# Altium schematic sheet BreakOut_20172.SchDoc
size A2; Author: Audran; CompanyName: Goldorak; Address1: Electrolab; Address2: 52 rue Paul Lescop; Address3: 92000 Nanterre; ProjectName: Cartes_2017
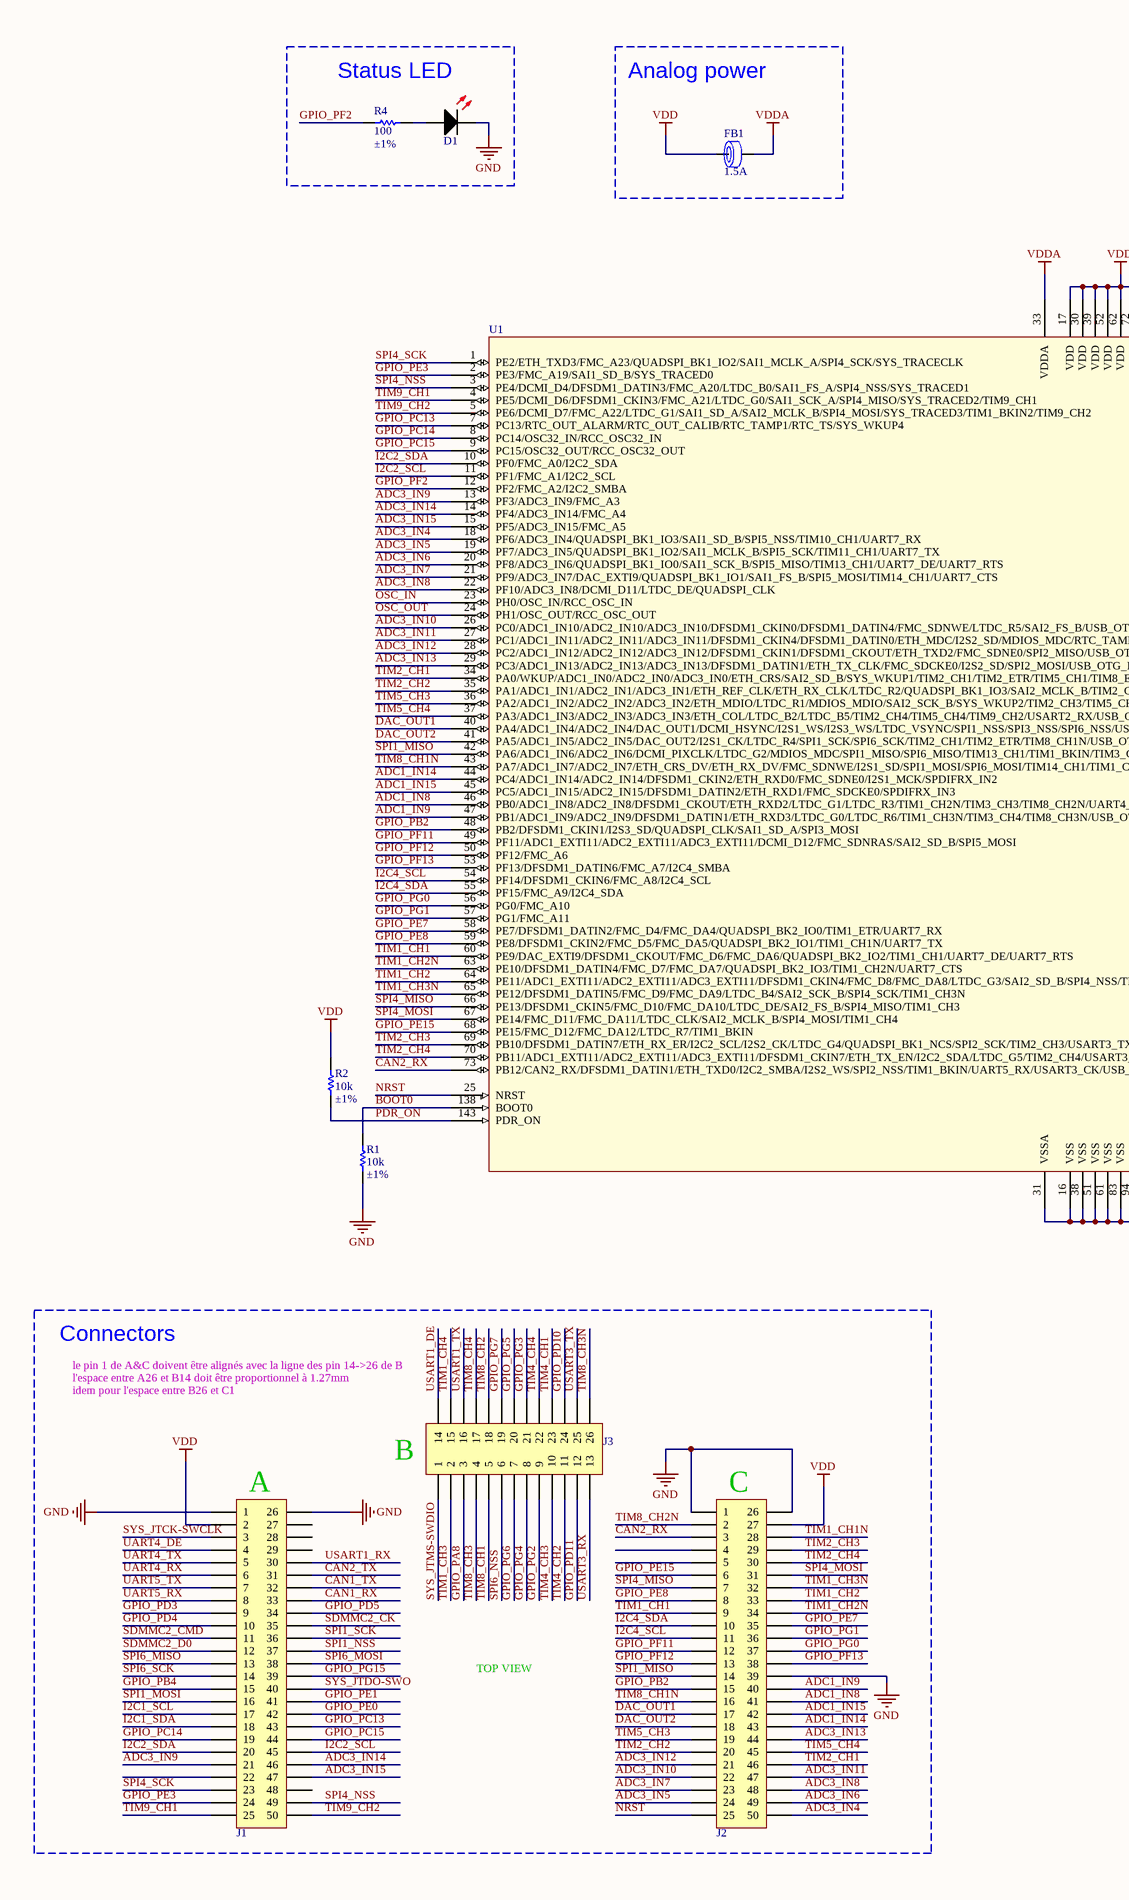
[diagram p0: BreakOut_20172.SchDoc, left]
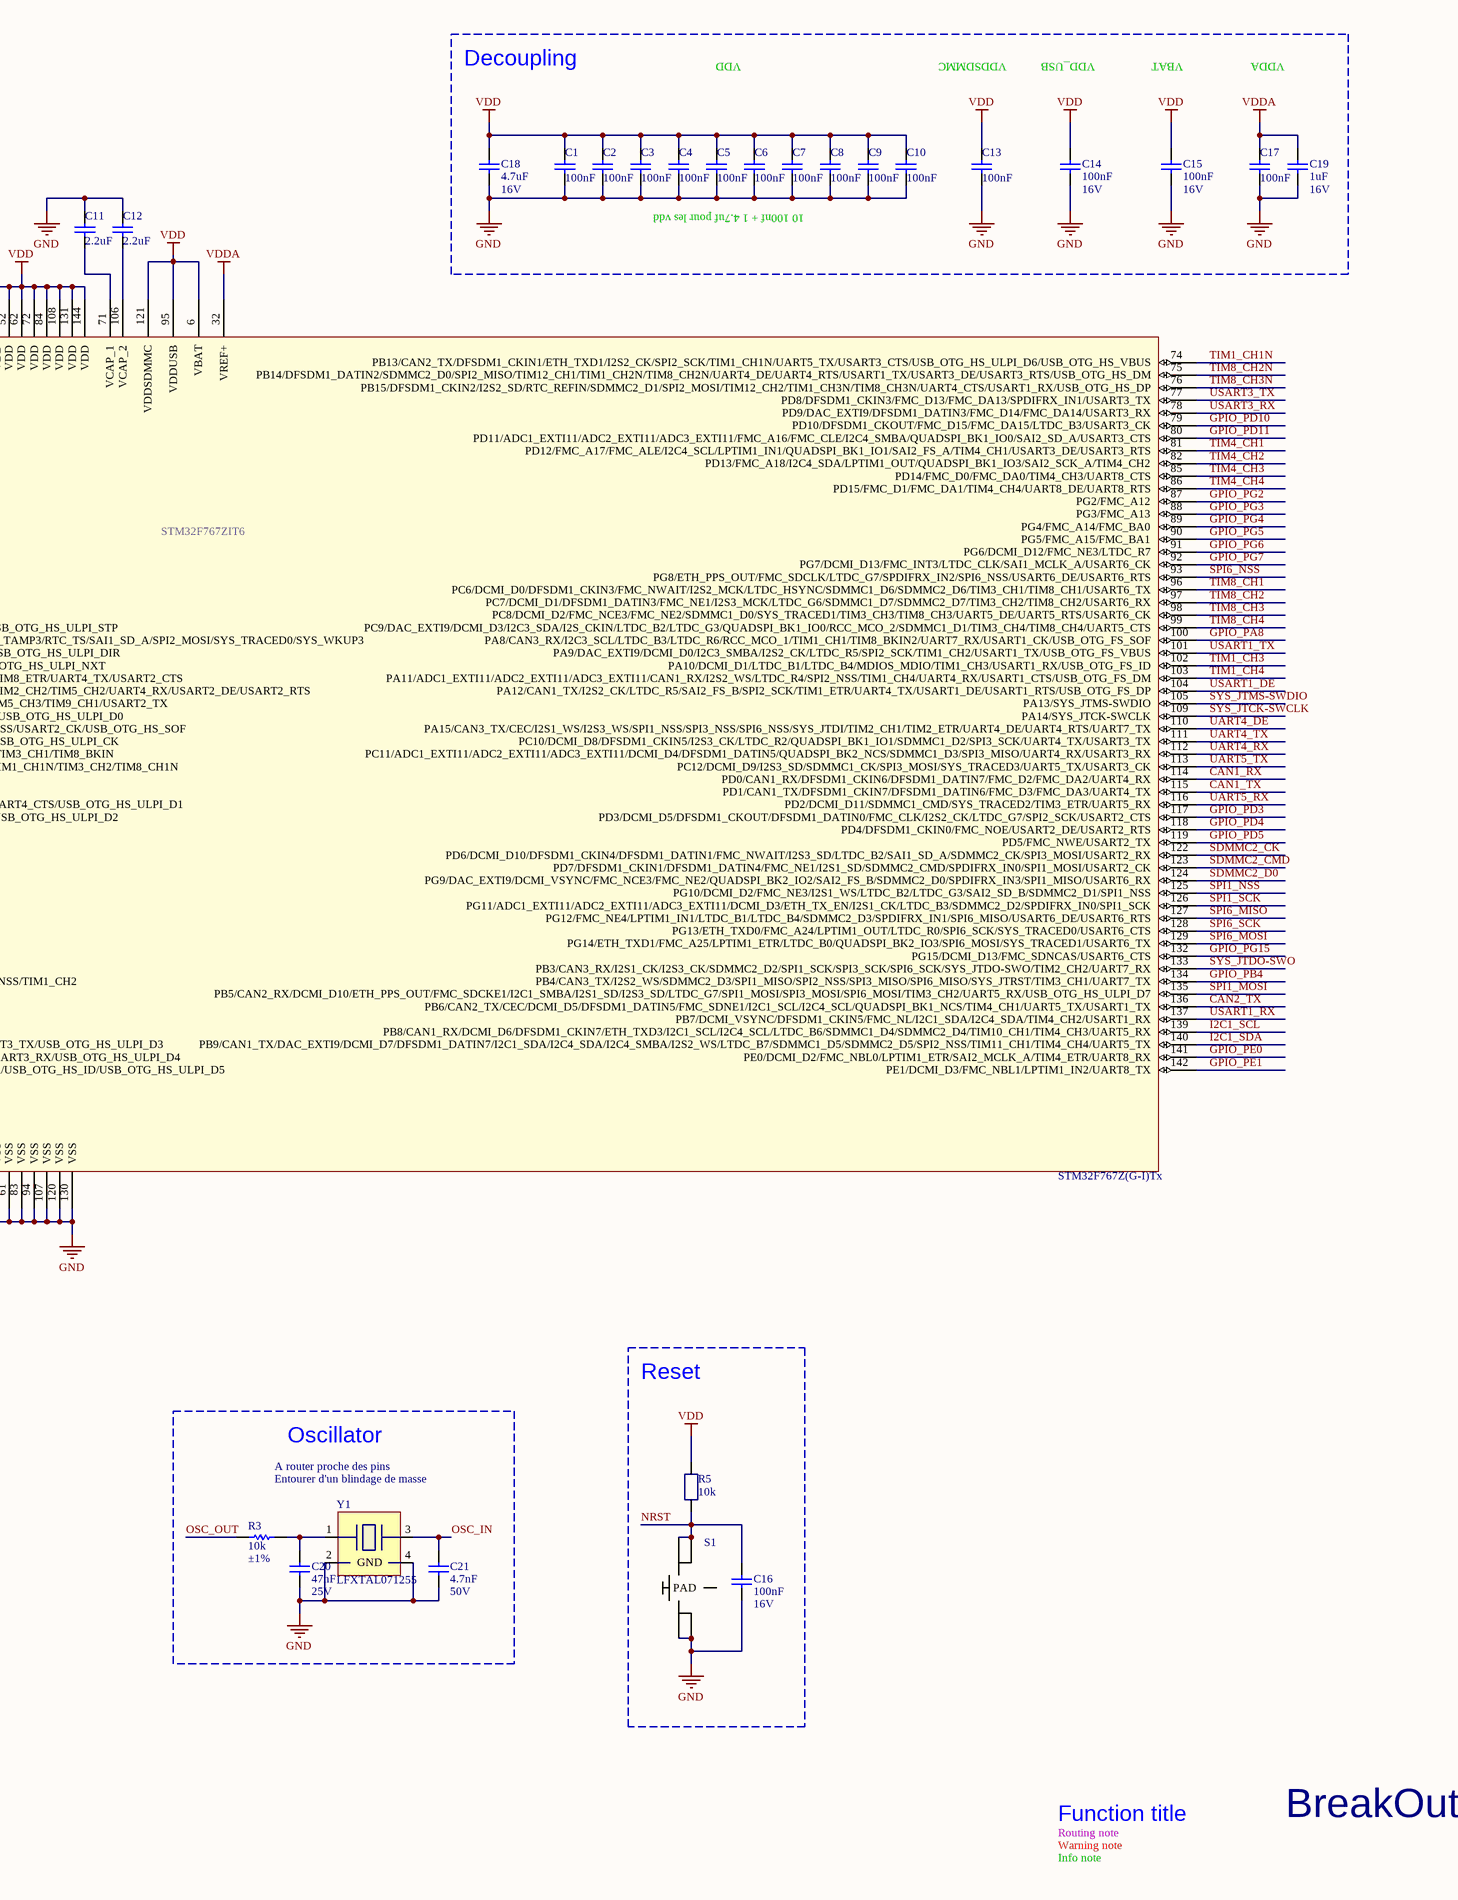
[diagram p1: BreakOut_20172.SchDoc, right]

## Parts
C1  100nF  [WCAP-CSGP_0402, 1x0.5x0.5]
C2  100nF  [WCAP-CSGP_0402, 1x0.5x0.5]
C3  100nF  [WCAP-CSGP_0402, 1x0.5x0.5]
C4  100nF  [WCAP-CSGP_0402, 1x0.5x0.5]
C5  100nF  [WCAP-CSGP_0402, 1x0.5x0.5]
C6  100nF  [WCAP-CSGP_0402, 1x0.5x0.5]
C7  100nF  [WCAP-CSGP_0402, 1x0.5x0.5]
C8  100nF  [WCAP-CSGP_0402, 1x0.5x0.5]
C9  100nF  [WCAP-CSGP_0402, 1x0.5x0.5]
C10  100nF  [WCAP-CSGP_0402, 1x0.5x0.5]
C11  2.2uF  [WCAP-CSGP_0603, 1.6x0.8x0.8]
C12  2.2uF  [WCAP-CSGP_0603, 1.6x0.8x0.8]
C13  100nF  [WCAP-CSGP_0402, 1x0.5x0.5]
C14  100nF  RatedVoltage: 16V  [WCAP-CSGP_0402, 1x0.5x0.5]
C15  100nF  RatedVoltage: 16V  [WCAP-CSGP_0402, 1x0.5x0.5]
C16  100nF  RatedVoltage: 16V  [WCAP-CSGP_0402, 1x0.5x0.5]
C17  100nF  [WCAP-CSGP_0402, 1x0.5x0.5]
C18  4.7uF  RatedVoltage: 16V  [WCAP-CSGP_0805, 2x1.25x1.25]
C19  1uF  RatedVoltage: 16V  [WCAP-CSGP_0603, 1.6x0.8x0.8]
C20  47nF  RatedVoltage: 25V  [WCAP-CSGP_0402, 1x0.5x0.5]
C21  4.7nF  RatedVoltage: 50V  [WCAP-CSGP_0402, 1x0.5x0.5]
D1  Rouge  [SMCW_0603]  (value not drawn)
FB1  RatedCurrent: 1.5A  [WE-CBF_0603_High Current]  (hidden comment: 742792624)
J1  WE-1.27 mm Socket Header 623350235321  [623350235321]  (value not drawn)
J2  WE-1.27 mm Socket Header 623350235321  [623350235321]  (value not drawn)
J3  WE-1.27 mm Socket Header 6623326235321  [623326235321]  (value not drawn)
R1  value 10k  Precision: ±1%  [RESC1005X04N]  (hidden comment: RC0402FR-0710KL)
R2  value 10k  Precision: ±1%  [RESC1005X04N]  (hidden comment: RC0402FR-0710KL)
R3  value 10k  Precision: ±1%  [RESC1005X04N]  (hidden comment: RC0402FR-0710KL)
R4  value 100  Precision: ±1%  [RESC1005X04N]  (hidden comment: RC0402FR-07100RL)
R5  10k  [R_0603_std]
S1  MCITPG  [MCIPTG23K-V]  (value not drawn)
U1  STM32F767Z(G-I)Tx  [TSQFP50P2200X2200X160-144N]
Y1  LFXTAL071255  [LFXTAL071255]

## Blocks framed on the sheet
Decoupling: C1-C10 C13-C15 C17-C19
Status LED: D1 R4
Analog power: FB1
Reset: C16 R5 S1
Oscillator: C20 C21 R3 Y1

## Nets
GND: C1.2 C2.1 C3.1 C4.1 C5.1 C6.1 C7.1 C8.1 C9.1 C10.1 C11.2 C12.2 C13.1 C14.1 C15.1 C16.1 C17.1 C18.1 C19.1 C20.1 C21.1 D1.1(C) J1.1 J1.26 J2.1 J2.26 J2.39 R1.1 S1.1 S1.3 U1.16(VSS) U1.31(VSSA) U1.38(VSS) U1.51(VSS) U1.61(VSS) U1.83(VSS) U1.94(VSS) U1.107(VSS) U1.120(VSS) U1.130(VSS) Y1.2(GND) Y1.4(GND)
VDD: C1.1 C2.2 C3.2 C4.2 C5.2 C6.2 C7.2 C8.2 C9.2 C10.2 C13.2 C14.2 C15.2 C18.2 FB1.1 J1.2 J2.27 R2.2 R5.1 U1.6(VBAT) U1.17(VDD) U1.30(VDD) U1.39(VDD) U1.52(VDD) U1.62(VDD) U1.72(VDD) U1.84(VDD) U1.95(VDDUSB) U1.108(VDD) U1.121(VDDSDMMC) U1.131(VDD) U1.144(VDD)
VDDA: C17.2 C19.2 FB1.2 U1.32(VREF+) U1.33(VDDA)
ADC1_IN8: J2.41 U1.46(PB0/ADC1_IN8/ADC2_IN8/DFSDM1_CKOUT/ETH_RXD2/LTDC_G1/LTDC_R3/TIM1_CH2N/TIM3_CH3/TIM8_CH2N/UART4_CTS/USB_OTG_HS_ULPI_D1)
ADC1_IN9: J2.40 U1.47(PB1/ADC1_IN9/ADC2_IN9/DFSDM1_DATIN1/ETH_RXD3/LTDC_G0/LTDC_R6/TIM1_CH3N/TIM3_CH4/TIM8_CH3N/USB_OTG_HS_ULPI_D2)
ADC1_IN14: J2.43 U1.44(PC4/ADC1_IN14/ADC2_IN14/DFSDM1_CKIN2/ETH_RXD0/FMC_SDNE0/I2S1_MCK/SPDIFRX_IN2)
ADC1_IN15: J2.42 U1.45(PC5/ADC1_IN15/ADC2_IN15/DFSDM1_DATIN2/ETH_RXD1/FMC_SDCKE0/SPDIFRX_IN3)
ADC3_IN4: J2.50 U1.18(PF6/ADC3_IN4/QUADSPI_BK1_IO3/SAI1_SD_B/SPI5_NSS/TIM10_CH1/UART7_RX)
ADC3_IN5: J2.24 U1.19(PF7/ADC3_IN5/QUADSPI_BK1_IO2/SAI1_MCLK_B/SPI5_SCK/TIM11_CH1/UART7_TX)
ADC3_IN6: J2.49 U1.20(PF8/ADC3_IN6/QUADSPI_BK1_IO0/SAI1_SCK_B/SPI5_MISO/TIM13_CH1/UART7_DE/UART7_RTS)
ADC3_IN7: J2.23 U1.21(PF9/ADC3_IN7/DAC_EXTI9/QUADSPI_BK1_IO1/SAI1_FS_B/SPI5_MOSI/TIM14_CH1/UART7_CTS)
ADC3_IN8: J2.48 U1.22(PF10/ADC3_IN8/DCMI_D11/LTDC_DE/QUADSPI_CLK)
ADC3_IN9: J1.21 U1.13(PF3/ADC3_IN9/FMC_A3)
ADC3_IN10: J2.22 U1.26(PC0/ADC1_IN10/ADC2_IN10/ADC3_IN10/DFSDM1_CKIN0/DFSDM1_DATIN4/FMC_SDNWE/LTDC_R5/SAI2_FS_B/USB_OTG_HS_ULPI_STP)
ADC3_IN11: J2.47 U1.27(PC1/ADC1_IN11/ADC2_IN11/ADC3_IN11/DFSDM1_CKIN4/DFSDM1_DATIN0/ETH_MDC/I2S2_SD/MDIOS_MDC/RTC_TAMP3/RTC_TS/SAI1_SD_A/SPI2_MOSI/SYS_TRACED0/SYS_WKUP3)
ADC3_IN12: J2.21 U1.28(PC2/ADC1_IN12/ADC2_IN12/ADC3_IN12/DFSDM1_CKIN1/DFSDM1_CKOUT/ETH_TXD2/FMC_SDNE0/SPI2_MISO/USB_OTG_HS_ULPI_DIR)
ADC3_IN13: J2.44 U1.29(PC3/ADC1_IN13/ADC2_IN13/ADC3_IN13/DFSDM1_DATIN1/ETH_TX_CLK/FMC_SDCKE0/I2S2_SD/SPI2_MOSI/USB_OTG_HS_ULPI_NXT)
ADC3_IN14: J1.46 U1.14(PF4/ADC3_IN14/FMC_A4)
ADC3_IN15: J1.47 U1.15(PF5/ADC3_IN15/FMC_A5)
BOOT0: R1.2 U1.138(BOOT0)
CAN1_RX: J1.33 U1.114(PD0/CAN1_RX/DFSDM1_CKIN6/DFSDM1_DATIN7/FMC_D2/FMC_DA2/UART4_RX)
CAN1_TX: J1.32 U1.115(PD1/CAN1_TX/DFSDM1_CKIN7/DFSDM1_DATIN6/FMC_D3/FMC_DA3/UART4_TX)
CAN2_RX: J2.3 U1.73(PB12/CAN2_RX/DFSDM1_DATIN1/ETH_TXD0/I2C2_SMBA/I2S2_WS/SPI2_NSS/TIM1_BKIN/UART5_RX/USART3_CK/USB_OTG_HS_ID/USB_OTG_HS_ULPI_D5)
CAN2_TX: J1.31 U1.136(PB6/CAN2_TX/CEC/DCMI_D5/DFSDM1_DATIN5/FMC_SDNE1/I2C1_SCL/I2C4_SCL/QUADSPI_BK1_NCS/TIM4_CH1/UART5_TX/USART1_TX)
DAC_OUT1: J2.17 U1.40(PA4/ADC1_IN4/ADC2_IN4/DAC_OUT1/DCMI_HSYNC/I2S1_WS/I2S3_WS/LTDC_VSYNC/SPI1_NSS/SPI3_NSS/SPI6_NSS/USART2_CK/USB_OTG_HS_SOF)
DAC_OUT2: J2.18 U1.41(PA5/ADC1_IN5/ADC2_IN5/DAC_OUT2/I2S1_CK/LTDC_R4/SPI1_SCK/SPI6_SCK/TIM2_CH1/TIM2_ETR/TIM8_CH1N/USB_OTG_HS_ULPI_CK)
GPIO_PA8: J3.3 U1.100(PA8/CAN3_RX/I2C3_SCL/LTDC_B3/LTDC_R6/RCC_MCO_1/TIM1_CH1/TIM8_BKIN2/UART7_RX/USART1_CK/USB_OTG_FS_SOF)
GPIO_PB2: J2.15 U1.48(PB2/DFSDM1_CKIN1/I2S3_SD/QUADSPI_CLK/SAI1_SD_A/SPI3_MOSI)
GPIO_PB4: J1.15 U1.134(PB4/CAN3_TX/I2S2_WS/SDMMC2_D3/SPI1_MISO/SPI2_NSS/SPI3_MISO/SPI6_MISO/SYS_JTRST/TIM3_CH1/UART7_TX)
GPIO_PC13: J1.43 U1.7(PC13/RTC_OUT_ALARM/RTC_OUT_CALIB/RTC_TAMP1/RTC_TS/SYS_WKUP4)
GPIO_PC14: J1.19 U1.8(PC14/OSC32_IN/RCC_OSC32_IN)
GPIO_PC15: J1.44 U1.9(PC15/OSC32_OUT/RCC_OSC32_OUT)
GPIO_PD3: J1.9 U1.117(PD3/DCMI_D5/DFSDM1_CKOUT/DFSDM1_DATIN0/FMC_CLK/I2S2_CK/LTDC_G7/SPI2_SCK/USART2_CTS)
GPIO_PD4: J1.10 U1.118(PD4/DFSDM1_CKIN0/FMC_NOE/USART2_DE/USART2_RTS)
GPIO_PD5: J1.34 U1.119(PD5/FMC_NWE/USART2_TX)
GPIO_PD10: J3.24 U1.79(PD10/DFSDM1_CKOUT/FMC_D15/FMC_DA15/LTDC_B3/USART3_CK)
GPIO_PD11: J3.12 U1.80(PD11/ADC1_EXTI11/ADC2_EXTI11/ADC3_EXTI11/FMC_A16/FMC_CLE/I2C4_SMBA/QUADSPI_BK1_IO0/SAI2_SD_A/USART3_CTS)
GPIO_PE0: J1.42 U1.141(PE0/DCMI_D2/FMC_NBL0/LPTIM1_ETR/SAI2_MCLK_A/TIM4_ETR/UART8_RX)
GPIO_PE1: J1.41 U1.142(PE1/DCMI_D3/FMC_NBL1/LPTIM1_IN2/UART8_TX)
GPIO_PE3: J1.24 U1.2(PE3/FMC_A19/SAI1_SD_B/SYS_TRACED0)
GPIO_PE7: J2.35 U1.58(PE7/DFSDM1_DATIN2/FMC_D4/FMC_DA4/QUADSPI_BK2_IO0/TIM1_ETR/UART7_RX)
GPIO_PE8: J2.8 U1.59(PE8/DFSDM1_CKIN2/FMC_D5/FMC_DA5/QUADSPI_BK2_IO1/TIM1_CH1N/UART7_TX)
GPIO_PE15: J2.6 U1.68(PE15/FMC_D12/FMC_DA12/LTDC_R7/TIM1_BKIN)
GPIO_PF2: R4.2 U1.12(PF2/FMC_A2/I2C2_SMBA)
GPIO_PF11: J2.12 U1.49(PF11/ADC1_EXTI11/ADC2_EXTI11/ADC3_EXTI11/DCMI_D12/FMC_SDNRAS/SAI2_SD_B/SPI5_MOSI)
GPIO_PF12: J2.13 U1.50(PF12/FMC_A6)
GPIO_PF13: J2.38 U1.53(PF13/DFSDM1_DATIN6/FMC_A7/I2C4_SMBA)
GPIO_PG0: J2.37 U1.56(PG0/FMC_A10)
GPIO_PG1: J2.36 U1.57(PG1/FMC_A11)
GPIO_PG2: J3.9 U1.87(PG2/FMC_A12)
GPIO_PG3: J3.21 U1.88(PG3/FMC_A13)
GPIO_PG4: J3.8 U1.89(PG4/FMC_A14/FMC_BA0)
GPIO_PG5: J3.20 U1.90(PG5/FMC_A15/FMC_BA1)
GPIO_PG6: J3.7 U1.91(PG6/DCMI_D12/FMC_NE3/LTDC_R7)
GPIO_PG7: J3.19 U1.92(PG7/DCMI_D13/FMC_INT3/LTDC_CLK/SAI1_MCLK_A/USART6_CK)
GPIO_PG15: J1.39 U1.132(PG15/DCMI_D13/FMC_SDNCAS/USART6_CTS)
I2C1_SCL: J1.17 U1.139(PB8/CAN1_RX/DCMI_D6/DFSDM1_CKIN7/ETH_TXD3/I2C1_SCL/I2C4_SCL/LTDC_B6/SDMMC1_D4/SDMMC2_D4/TIM10_CH1/TIM4_CH3/UART5_RX)
I2C1_SDA: J1.18 U1.140(PB9/CAN1_TX/DAC_EXTI9/DCMI_D7/DFSDM1_DATIN7/I2C1_SDA/I2C4_SDA/I2C4_SMBA/I2S2_WS/LTDC_B7/SDMMC1_D5/SDMMC2_D5/SPI2_NSS/TIM11_CH1/TIM4_CH4/UART5_TX)
I2C2_SCL: J1.45 U1.11(PF1/FMC_A1/I2C2_SCL)
I2C2_SDA: J1.20 U1.10(PF0/FMC_A0/I2C2_SDA)
I2C4_SCL: J2.11 U1.54(PF14/DFSDM1_CKIN6/FMC_A8/I2C4_SCL)
I2C4_SDA: J2.10 U1.55(PF15/FMC_A9/I2C4_SDA)
NRST: C16.2 J2.25 R5.2 S1.2 S1.4 U1.25(NRST)
OSC_IN: C21.2 U1.23(PH0/OSC_IN/RCC_OSC_IN) Y1.3
OSC_OUT: R3.2 U1.24(PH1/OSC_OUT/RCC_OSC_OUT)
PDR_ON: R2.1 U1.143(PDR_ON)
SDMMC2_CK: J1.35 U1.122(PD6/DCMI_D10/DFSDM1_CKIN4/DFSDM1_DATIN1/FMC_NWAIT/I2S3_SD/LTDC_B2/SAI1_SD_A/SDMMC2_CK/SPI3_MOSI/USART2_RX)
SDMMC2_CMD: J1.11 U1.123(PD7/DFSDM1_CKIN1/DFSDM1_DATIN4/FMC_NE1/I2S1_SD/SDMMC2_CMD/SPDIFRX_IN0/SPI1_MOSI/USART2_CK)
SDMMC2_D0: J1.12 U1.124(PG9/DAC_EXTI9/DCMI_VSYNC/FMC_NCE3/FMC_NE2/QUADSPI_BK2_IO2/SAI2_FS_B/SDMMC2_D0/SPDIFRX_IN3/SPI1_MISO/USART6_RX)
SPI1_MISO: J2.14 U1.42(PA6/ADC1_IN6/ADC2_IN6/DCMI_PIXCLK/LTDC_G2/MDIOS_MDC/SPI1_MISO/SPI6_MISO/TIM13_CH1/TIM1_BKIN/TIM3_CH1/TIM8_BKIN)
SPI1_MOSI: J1.16 U1.135(PB5/CAN2_RX/DCMI_D10/ETH_PPS_OUT/FMC_SDCKE1/I2C1_SMBA/I2S1_SD/I2S3_SD/LTDC_G7/SPI1_MOSI/SPI3_MOSI/SPI6_MOSI/TIM3_CH2/UART5_RX/USB_OTG_HS_ULPI_D7)
SPI1_NSS: J1.37 U1.125(PG10/DCMI_D2/FMC_NE3/I2S1_WS/LTDC_B2/LTDC_G3/SAI2_SD_B/SDMMC2_D1/SPI1_NSS)
SPI1_SCK: J1.36 U1.126(PG11/ADC1_EXTI11/ADC2_EXTI11/ADC3_EXTI11/DCMI_D3/ETH_TX_EN/I2S1_CK/LTDC_B3/SDMMC2_D2/SPDIFRX_IN0/SPI1_SCK)
SPI4_MISO: J2.7 U1.66(PE13/DFSDM1_CKIN5/FMC_D10/FMC_DA10/LTDC_DE/SAI2_FS_B/SPI4_MISO/TIM1_CH3)
SPI4_MOSI: J2.31 U1.67(PE14/FMC_D11/FMC_DA11/LTDC_CLK/SAI2_MCLK_B/SPI4_MOSI/TIM1_CH4)
SPI4_NSS: J1.49 U1.3(PE4/DCMI_D4/DFSDM1_DATIN3/FMC_A20/LTDC_B0/SAI1_FS_A/SPI4_NSS/SYS_TRACED1)
SPI4_SCK: J1.23 U1.1(PE2/ETH_TXD3/FMC_A23/QUADSPI_BK1_IO2/SAI1_MCLK_A/SPI4_SCK/SYS_TRACECLK)
SPI6_MISO: J1.13 U1.127(PG12/FMC_NE4/LPTIM1_IN1/LTDC_B1/LTDC_B4/SDMMC2_D3/SPDIFRX_IN1/SPI6_MISO/USART6_DE/USART6_RTS)
SPI6_MOSI: J1.38 U1.129(PG14/ETH_TXD1/FMC_A25/LPTIM1_ETR/LTDC_B0/QUADSPI_BK2_IO3/SPI6_MOSI/SYS_TRACED1/USART6_TX)
SPI6_NSS: J3.6 U1.93(PG8/ETH_PPS_OUT/FMC_SDCLK/LTDC_G7/SPDIFRX_IN2/SPI6_NSS/USART6_DE/USART6_RTS)
SPI6_SCK: J1.14 U1.128(PG13/ETH_TXD0/FMC_A24/LPTIM1_OUT/LTDC_R0/SPI6_SCK/SYS_TRACED0/USART6_CTS)
SYS_JTCK-SWCLK: J1.3 U1.109(PA14/SYS_JTCK-SWCLK)
SYS_JTDO-SWO: J1.40 U1.133(PB3/CAN3_RX/I2S1_CK/I2S3_CK/SDMMC2_D2/SPI1_SCK/SPI3_SCK/SPI6_SCK/SYS_JTDO-SWO/TIM2_CH2/UART7_RX)
SYS_JTMS-SWDIO: J3.1 U1.105(PA13/SYS_JTMS-SWDIO)
TIM1_CH1: J2.9 U1.60(PE9/DAC_EXTI9/DFSDM1_CKOUT/FMC_D6/FMC_DA6/QUADSPI_BK2_IO2/TIM1_CH1/UART7_DE/UART7_RTS)
TIM1_CH1N: J2.28 U1.74(PB13/CAN2_TX/DFSDM1_CKIN1/ETH_TXD1/I2S2_CK/SPI2_SCK/TIM1_CH1N/UART5_TX/USART3_CTS/USB_OTG_HS_ULPI_D6/USB_OTG_HS_VBUS)
TIM1_CH2: J2.33 U1.64(PE11/ADC1_EXTI11/ADC2_EXTI11/ADC3_EXTI11/DFSDM1_CKIN4/FMC_D8/FMC_DA8/LTDC_G3/SAI2_SD_B/SPI4_NSS/TIM1_CH2)
TIM1_CH2N: J2.34 U1.63(PE10/DFSDM1_DATIN4/FMC_D7/FMC_DA7/QUADSPI_BK2_IO3/TIM1_CH2N/UART7_CTS)
TIM1_CH3: J3.2 U1.102(PA10/DCMI_D1/LTDC_B1/LTDC_B4/MDIOS_MDIO/TIM1_CH3/USART1_RX/USB_OTG_FS_ID)
TIM1_CH3N: J2.32 U1.65(PE12/DFSDM1_DATIN5/FMC_D9/FMC_DA9/LTDC_B4/SAI2_SCK_B/SPI4_SCK/TIM1_CH3N)
TIM1_CH4: J3.15 U1.103(PA11/ADC1_EXTI11/ADC2_EXTI11/ADC3_EXTI11/CAN1_RX/I2S2_WS/LTDC_R4/SPI2_NSS/TIM1_CH4/UART4_RX/USART1_CTS/USB_OTG_FS_DM)
TIM2_CH1: J2.46 U1.34(PA0/WKUP/ADC1_IN0/ADC2_IN0/ADC3_IN0/ETH_CRS/SAI2_SD_B/SYS_WKUP1/TIM2_CH1/TIM2_ETR/TIM5_CH1/TIM8_ETR/UART4_TX/USART2_CTS)
TIM2_CH2: J2.20 U1.35(PA1/ADC1_IN1/ADC2_IN1/ADC3_IN1/ETH_REF_CLK/ETH_RX_CLK/LTDC_R2/QUADSPI_BK1_IO3/SAI2_MCLK_B/TIM2_CH2/TIM5_CH2/UART4_RX/USART2_DE/USART2_RTS)
TIM2_CH3: J2.29 U1.69(PB10/DFSDM1_DATIN7/ETH_RX_ER/I2C2_SCL/I2S2_CK/LTDC_G4/QUADSPI_BK1_NCS/SPI2_SCK/TIM2_CH3/USART3_TX/USB_OTG_HS_ULPI_D3)
TIM2_CH4: J2.30 U1.70(PB11/ADC1_EXTI11/ADC2_EXTI11/ADC3_EXTI11/DFSDM1_CKIN7/ETH_TX_EN/I2C2_SDA/LTDC_G5/TIM2_CH4/USART3_RX/USB_OTG_HS_ULPI_D4)
TIM4_CH1: J3.23 U1.81(PD12/FMC_A17/FMC_ALE/I2C4_SCL/LPTIM1_IN1/QUADSPI_BK1_IO1/SAI2_FS_A/TIM4_CH1/USART3_DE/USART3_RTS)
TIM4_CH2: J3.11 U1.82(PD13/FMC_A18/I2C4_SDA/LPTIM1_OUT/QUADSPI_BK1_IO3/SAI2_SCK_A/TIM4_CH2)
TIM4_CH3: J3.10 U1.85(PD14/FMC_D0/FMC_DA0/TIM4_CH3/UART8_CTS)
TIM4_CH4: J3.22 U1.86(PD15/FMC_D1/FMC_DA1/TIM4_CH4/UART8_DE/UART8_RTS)
TIM5_CH3: J2.19 U1.36(PA2/ADC1_IN2/ADC2_IN2/ADC3_IN2/ETH_MDIO/LTDC_R1/MDIOS_MDIO/SAI2_SCK_B/SYS_WKUP2/TIM2_CH3/TIM5_CH3/TIM9_CH1/USART2_TX)
TIM5_CH4: J2.45 U1.37(PA3/ADC1_IN3/ADC2_IN3/ADC3_IN3/ETH_COL/LTDC_B2/LTDC_B5/TIM2_CH4/TIM5_CH4/TIM9_CH2/USART2_RX/USB_OTG_HS_ULPI_D0)
TIM8_CH1: J3.5 U1.96(PC6/DCMI_D0/DFSDM1_CKIN3/FMC_NWAIT/I2S2_MCK/LTDC_HSYNC/SDMMC1_D6/SDMMC2_D6/TIM3_CH1/TIM8_CH1/USART6_TX)
TIM8_CH1N: J2.16 U1.43(PA7/ADC1_IN7/ADC2_IN7/ETH_CRS_DV/ETH_RX_DV/FMC_SDNWE/I2S1_SD/SPI1_MOSI/SPI6_MOSI/TIM14_CH1/TIM1_CH1N/TIM3_CH2/TIM8_CH1N)
TIM8_CH2: J3.18 U1.97(PC7/DCMI_D1/DFSDM1_DATIN3/FMC_NE1/I2S3_MCK/LTDC_G6/SDMMC1_D7/SDMMC2_D7/TIM3_CH2/TIM8_CH2/USART6_RX)
TIM8_CH2N: J2.2 U1.75(PB14/DFSDM1_DATIN2/SDMMC2_D0/SPI2_MISO/TIM12_CH1/TIM1_CH2N/TIM8_CH2N/UART4_DE/UART4_RTS/USART1_TX/USART3_DE/USART3_RTS/USB_OTG_HS_DM)
TIM8_CH3: J3.4 U1.98(PC8/DCMI_D2/FMC_NCE3/FMC_NE2/SDMMC1_D0/SYS_TRACED1/TIM3_CH3/TIM8_CH3/UART5_DE/UART5_RTS/USART6_CK)
TIM8_CH3N: J3.26 U1.76(PB15/DFSDM1_CKIN2/I2S2_SD/RTC_REFIN/SDMMC2_D1/SPI2_MOSI/TIM12_CH2/TIM1_CH3N/TIM8_CH3N/UART4_CTS/USART1_RX/USB_OTG_HS_DP)
TIM8_CH4: J3.17 U1.99(PC9/DAC_EXTI9/DCMI_D3/I2C3_SDA/I2S_CKIN/LTDC_B2/LTDC_G3/QUADSPI_BK1_IO0/RCC_MCO_2/SDMMC1_D1/TIM3_CH4/TIM8_CH4/UART5_CTS)
TIM9_CH1: J1.25 U1.4(PE5/DCMI_D6/DFSDM1_CKIN3/FMC_A21/LTDC_G0/SAI1_SCK_A/SPI4_MISO/SYS_TRACED2/TIM9_CH1)
TIM9_CH2: J1.50 U1.5(PE6/DCMI_D7/FMC_A22/LTDC_G1/SAI1_SD_A/SAI2_MCLK_B/SPI4_MOSI/SYS_TRACED3/TIM1_BKIN2/TIM9_CH2)
UART4_DE: J1.4 U1.110(PA15/CAN3_TX/CEC/I2S1_WS/I2S3_WS/SPI1_NSS/SPI3_NSS/SPI6_NSS/SYS_JTDI/TIM2_CH1/TIM2_ETR/UART4_DE/UART4_RTS/UART7_TX)
UART4_RX: J1.6 U1.112(PC11/ADC1_EXTI11/ADC2_EXTI11/ADC3_EXTI11/DCMI_D4/DFSDM1_DATIN5/QUADSPI_BK2_NCS/SDMMC1_D3/SPI3_MISO/UART4_RX/USART3_RX)
UART4_TX: J1.5 U1.111(PC10/DCMI_D8/DFSDM1_CKIN5/I2S3_CK/LTDC_R2/QUADSPI_BK1_IO1/SDMMC1_D2/SPI3_SCK/UART4_TX/USART3_TX)
UART5_RX: J1.8 U1.116(PD2/DCMI_D11/SDMMC1_CMD/SYS_TRACED2/TIM3_ETR/UART5_RX)
UART5_TX: J1.7 U1.113(PC12/DCMI_D9/I2S3_SD/SDMMC1_CK/SPI3_MOSI/SYS_TRACED3/UART5_TX/USART3_CK)
USART1_DE: J3.14 U1.104(PA12/CAN1_TX/I2S2_CK/LTDC_R5/SAI2_FS_B/SPI2_SCK/TIM1_ETR/UART4_TX/USART1_DE/USART1_RTS/USB_OTG_FS_DP)
USART1_RX: J1.30 U1.137(PB7/DCMI_VSYNC/DFSDM1_CKIN5/FMC_NL/I2C1_SDA/I2C4_SDA/TIM4_CH2/USART1_RX)
USART1_TX: J3.16 U1.101(PA9/DAC_EXTI9/DCMI_D0/I2C3_SMBA/I2S2_CK/LTDC_R5/SPI2_SCK/TIM1_CH2/USART1_TX/USB_OTG_FS_VBUS)
USART3_RX: J3.13 U1.78(PD9/DAC_EXTI9/DFSDM1_DATIN3/FMC_D14/FMC_DA14/USART3_RX)
USART3_TX: J3.25 U1.77(PD8/DFSDM1_CKIN3/FMC_D13/FMC_DA13/SPDIFRX_IN1/USART3_TX)
NetC11_1: C11.1 U1.71(VCAP_1)
NetC12_1: C12.1 U1.106(VCAP_2)
NetC20_2: C20.2 R3.1 Y1.1
NetD1_2: D1.2(A) R4.1

Not connected (* = marked no-connect by the designer): J1 22 27 28 29 48; J2 4 5; S1 5(PAD)

## Notes on the sheet
- VDD
- VDDSDMMC
- VDD_USB
- VBAT
- VDDA
- 10 100nf + 1 4.7uf pour les vdd
- Connectors
- le pin 1 de A&C doivent être alignés avec la ligne des pin 14->26 de B
- l'espace entre A26 et B14 doit être proportionnel à 1.27mm
- idem pour l'espace entre B26 et C1
- (near J1) A
- (near J3) B
- (near J2) C
- A router proche des pins
- Entourer d'un blindage de masse
- TOP VIEW
- Function title
- BreakOut 2017
- Routing note
- Warning note
- Info note

## Library data of the parts
C1-C10 C13-C17 = WCAP-CSGP, 885012205037: CAP CER 100nF 16V X7R 0402; Manufacturer: Wurth Elektronik; Manufacturer Part Number: 885012205037; ComponentLink1URL: http://www.we-online.de; ComponentLink1Description: Manufacturer; Value: 100nF; PublishedDate: Aug 2016; ComponentLink2Description: Datasheet; ComponentLink2URL: http://katalog.we-online.com/pbs/datasheet/885012205037.pdf; Size: 0402; CeramicType: X7R
  C13 C17: RatedVoltage: 16V
C11 C12 = WCAP-CSGP, 885012206027: CAP CER 2.2uF 10V X7R 0603; Manufacturer: Wurth Elektronik; Manufacturer Part Number: 885012206027; ComponentLink1URL: http://www.we-online.de; ComponentLink1Description: Manufacturer; ComponentLink2URL: http://katalog.we-online.com/pbs/datasheet/885012206027.pdf; ComponentLink2Description: Datasheet; PublishedDate: Aug 2016; Value: 2.2uF; Size: 0603; CeramicType: X7R
C18 = WCAP-CSGP, 885012207053: CAP CER 4.7uF 16V X7R 0805; Manufacturer: Wurth Elektronik; Manufacturer Part Number: 885012207053; ComponentLink1URL: http://www.we-online.de; ComponentLink1Description: Manufacturer; ComponentLink2URL: http://katalog.we-online.com/pbs/datasheet/885012207053.pdf; ComponentLink2Description: Datasheet; PublishedDate: Aug 2016; Value: 4.7uF; Size: 0805; CeramicType: X7R
C19 = WCAP-CSGP, 885012106017: CAP CER 1UF 16V X5R 0603; Manufacturer: Wurth Elektronik; Manufacturer Part Number: 885012106017; ComponentLink1URL: http://www.we-online.de; ComponentLink1Description: Manufacturer; ComponentLink2URL: http://katalog.we-online.com/pbs/datasheet/885012106017.pdf; ComponentLink2Description: Datasheet; PublishedDate: Aug 2016; Value: 1uF; Size: 0603; CeramicType: X5R
C20 = WCAP-CSGP, 885012205054: CAP CER 47nF 25V X7R 0402; Manufacturer: Wurth Elektronik; Manufacturer Part Number: 885012205054; ComponentLink1URL: http://www.we-online.de; ComponentLink1Description: Manufacturer; ComponentLink2URL: http://katalog.we-online.com/pbs/datasheet/885012205054.pdf; ComponentLink2Description: Datasheet; PublishedDate: Aug 2016; Value: 47nF; Size: 0402; CeramicType: X7R
C21 = WCAP-CSGP, 885012205065: CAP CER 4.7nF 50V X7R 0402; Manufacturer: Wurth Elektronik; Manufacturer Part Number: 885012205065; ComponentLink1URL: http://www.we-online.de; ComponentLink1Description: Manufacturer; ComponentLink2URL: http://katalog.we-online.com/pbs/datasheet/885012205065.pdf; ComponentLink2Description: Datasheet; PublishedDate: Aug 2016; Value: 4.7nF; Size: 0402; CeramicType: X7R
D1 = LED 0603 Rouge: WL-SMCW SMD LED Rouge; Manufacturer 1: WURTH ELEKTRONIK; Manufacturer Part Number: 150060RS75000; Supplier 1: Farnell; Supplier Part Number 1: 2322071; Pricing: 1=0.212, 50=0.18, 100=0.162, 500=0.129, 2000=0.116, 5000=0.104, 5000=0.094, 50000=0.0846 (EUR); ComponentLink1URL: http://katalog.we-online.de/led/datasheet/150060RS75000.pdf; ComponentLink1Description: http://katalog.we-online.de/led/datasheet/150060RS75000.pdf
FB1 = WE-CBF, 742792624: Ferrite Bead 180ohm 0603 max1.5A; Manufacturer: Wurth Elektronik; Value: 180Ω; Type: High Current; PublishedDate: Aug 2016; ComponentLink1Description: Manufacturer; ComponentLink1URL: http://www.we-online.de; ComponentLink2Description: Datasheet; ComponentLink2URL: http://katalog.we-online.de/pbs/datasheet/742792624.pdf; Manufacturer Part Number: 742792624; Size: 0603
J1 J2 = WE-1.27 mm Socket Header 623350235321: WR-PHD 1.27 mm Dual SMT Socket Header H=2.10mm; Manufacturer 1: Wuerth Elektronik; ComponentLink1 Description: Manufacturer; ComponentLink2 Description: Datasheet; Value: 50; ComponentLink1URL: http://www.we-online.com; ComponentLink2URL: http://katalog.we-online.de/em/datasheet/6233xx235321.pdf; Manufacturer Part Number: 623350235321
J3 = WE-1.27 mm Socket Header 623326235321: WR-PHD 1.27 mm Dual SMT Socket Header H=2.10mm; Manufacturer 1: Wuerth Elektronik; ComponentLink1 Description: Manufacturer; ComponentLink2 Description: Datasheet; Value: 50; ComponentLink1URL: http://www.we-online.com; ComponentLink2URL: http://katalog.we-online.de/em/datasheet/6233xx235321.pdf; Manufacturer Part Number: 623326235321
R1-R3 = RC0402FR-0710KL: RES SMD 10K OHM 1% 1/16W 0402; Manufacturer: Yageo; Power: 63mW; Vmax: 50V; Manufacturer Part Number: RC0402FR-0710KL; ComponentLink1URL: http://www.yageo.com/NewPortal/_en/index.jsp; ComponentLink1Description: Manufacturer; Supplier 1: Farnell; Supplier Part Number 1: 9239359; Type: Thick Film; ComponentLink2Description: Datasheet; ComponentLink2URL: http://www.farnell.com/datasheets/2167052.pdf
R4 = RC0402FR-07100RL: RES SMD 100 OHM 1% 1/16W 0402; Manufacturer: Yageo; Power: 63mW; Vmax: 50V; Manufacturer Part Number: RC0402FR-07100RL; ComponentLink1URL: http://www.yageo.com/NewPortal/_en/index.jsp; ComponentLink1Description: Manufacturer; Supplier 1: Farnell; Supplier Part Number 1: 9239111; Type: Thick Film; ComponentLink2Description: Datasheet; ComponentLink2URL: http://www.farnell.com/datasheets/2167052.pdf
R5 = R_10k_0603: Resistance 10k 5% pkg 0603; Manufacturer: TE CONNECTIVITY; Manufacturer Part Number: TLRS157550ER002FTDG; Pricing: 1=2,3, 25=2, 100=1,81, 500=1,63, 2000=1,31 (EUR); ComponentLink1URL: http://www.farnell.com/datasheets/1751344.pdf; ComponentLink1Description: http://www.farnell.com/datasheets/1751344.pdf; value: 10k; Supplier 1: Farnell; Supplier Part Number 1: 1739174
S1 = MCIPTG23K-V: Switch MCIPTG23K-V Multicomp; Supplier 1: Farnell; Supplier Part Number 1: 1605470; Manufacturer: MULTICOMP; Manufacturer Part Number: MCIPTG23K-V; Pricing: 1=0.7, 50=0.65, 100=0.61, 500=0.57, 1000=0.53, 7000=0.37, 7000=0.333, 30000=0.3 (EUR); ComponentLink1URL: http://www.farnell.com/cad/1662547.pdf; ComponentLink1Description: http://www.farnell.com/cad/1662547.pdf
U1 = STM32F767ZIT6: Manufacturer: STMICROELECTRONICS; Pricing: 1=0.5, 25=0.4, 100=0.33, 250=0.27, 500=0.228, 2000=0.16, 2000=0.157, 20000=0.154 (EUR); ComponentLink1URL: http://www.farnell.com/datasheets/2282439.pdf; ComponentLink1Description: Datasheet; Supplier 1: Farnell; Supplier Part Number 1: 2535499; Manufacturer Part Number: STM32F767ZIT6
Y1 = LFXTAL071255: Quartz 16MHz 10pF CMS 4P ~2x1.6mm; Manufacturer: IQD; Supplier 1: Farnell; Manufacturer Part Number: LFXTAL071255; ComponentLink1Url: http://www.farnell.com/datasheets/2080670.pdf; ComponentLink1Description: Datasheet; Supplier Part Number 1: 2612484